# EAGLE schematic motor (EAGLE 9.3.2)
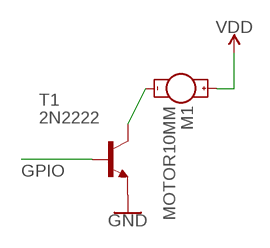
[diagram p0: schematic, sheet 1]

## Parts
M1  MOTOR10MM  [VIBE-MOTOR-10MM]
T1  2N2222  [TO92-EBC-OVAL]

## Nets
GND: T1.E
GPIO: T1.B
N$1: M1.- T1.C
VDD: M1.+

## Library data of the parts
M1 = SparkFun-Electromechanical:MOTOR: Motor (Single-Phase) Two-terminal, single-phase motors. SparkFun Products Vibration Motor <https://www.sparkfun.com/products/8449> (ROB-08449) Physical dimension and wire connections for this powerful vibration motor. Motor has a self adhesive backing.; PROD_ID: COMP-08572; SF_SKU: ROB-08449
T1 = adafruit:2N2222: NPN TRANSISTOR Big oval pads